# Altium schematic sheet PowerManagement.SchDoc: Power management
size A4; SheetNumber: 4; SheetTotal: 7
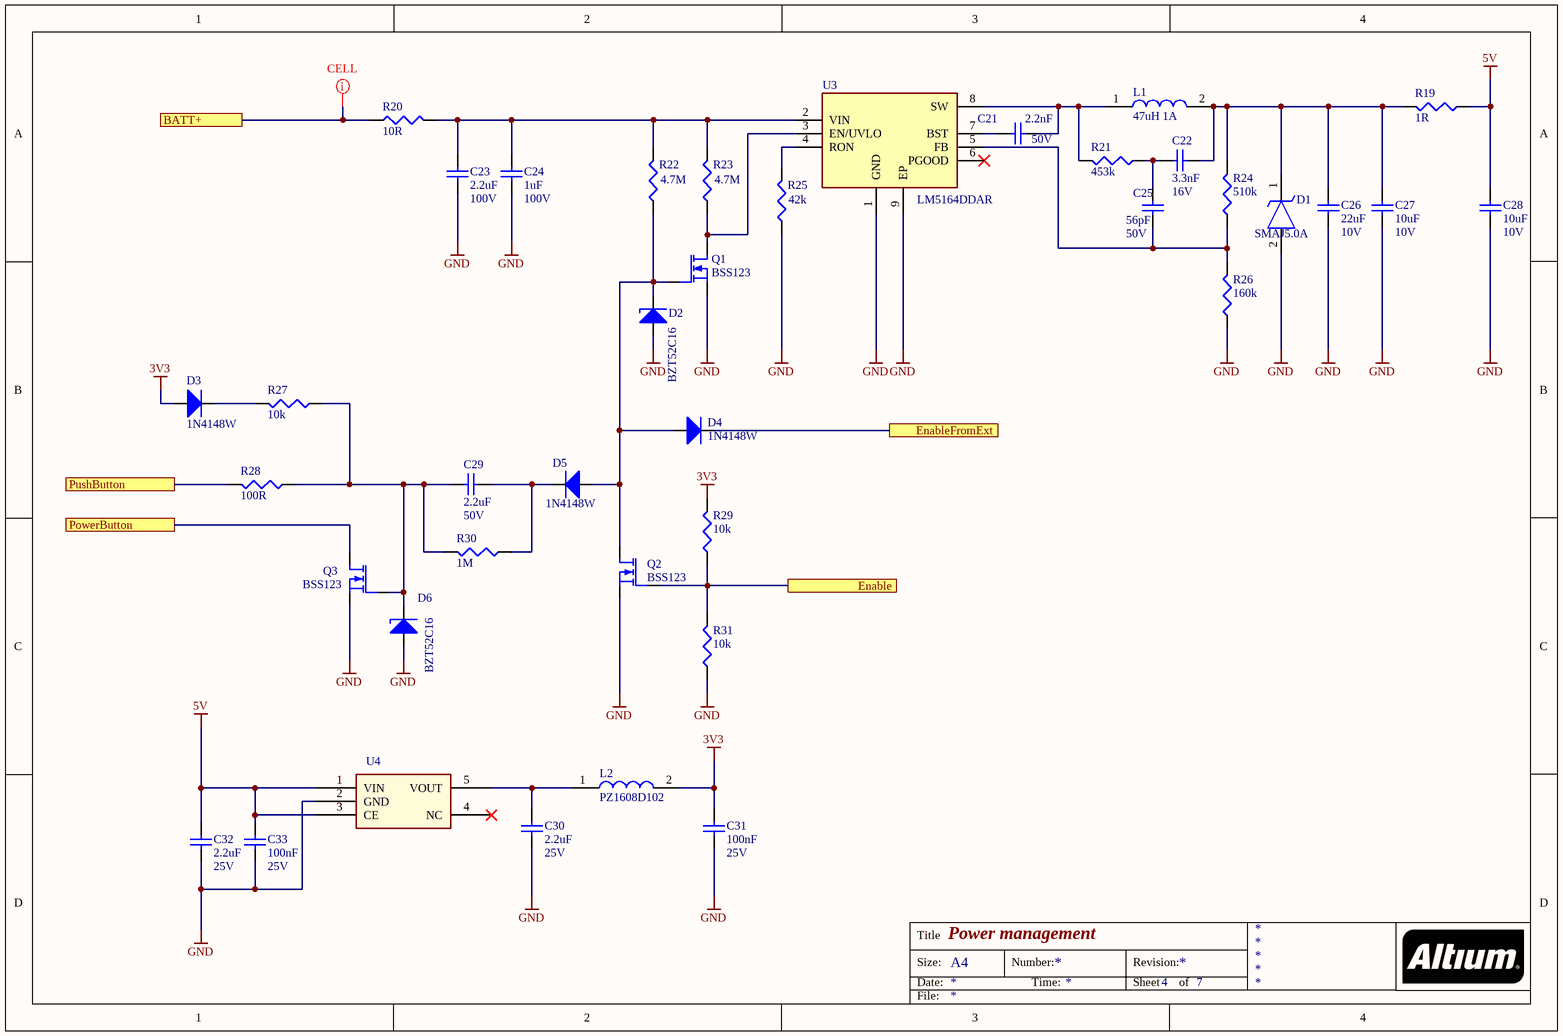
[diagram p0: PowerManagement.SchDoc]

## Parts
C21  2.2nF  Voltage Rating: 50V  [C0402]
C22  3.3nF  Voltage Rating: 16V  [C0402]
C23  2.2uF  Voltage Rating: 100V  [C-1206]
C24  1uF  Voltage Rating: 100V  [C-1206]
C25  56pF  Voltage Rating: 50V  [C0402]
C26  22uF  Voltage Rating: 10V  [C-0805]
C27  10uF  Voltage Rating: 10V  [C-0805]
C28  10uF  Voltage Rating: 10V  [C-0805]
C29  2.2uF  Voltage Rating: 50V  [C-0805]
C30  2.2uF  Voltage Rating: 25V  [C0402]
C31  100nF  Voltage Rating: 25V  [C0402]
C32  2.2uF  Voltage Rating: 25V  [C0402]
C33  100nF  Voltage Rating: 25V  [C0402]
D1  SMAJ5.0A  [SOD-123F]
D2  BZT52C16  [SOD123]
D3  1N4148W  [SOD123]
D4  1N4148W  [SOD123]
D5  1N4148W  [SOD123]
D6  BZT52C16  [SOD123]
L1  47uH 1A  [L5040]
L2  PZ1608D102  [L0603]
Q1  BSS123  [SOT-23]
Q2  BSS123  [SOT-23]
Q3  BSS123  [SOT-23]
R19  1R  [0805]
R20  10R  [R1206]
R21  453k  [0402]
R22  4.7M  [0402]
R23  4.7M  [0402]
R24  510k  [0402]
R25  42k  [0402]
R26  160k  [0402]
R27  10k  [0402]
R28  100R  [0603]
R29  10k  [0402]
R30  1M  [0402]
R31  10k  [0402]
U3  LM5164DDAR  [SOIC127P600X170-9N]
U4  XC6219B332MR  [SOT-23-5]  (value not drawn)

## Ports
BATT+, Enable, EnableFromExt, PowerButton, PushButton

## Nets
3V3: C31.1 D3.1(A) L2.2 R29.2
5V: C28.2 C32.1 C33.1 R19.1 U4.1(VIN) U4.3(CE)
GND: C23.1 C24.1 C26.1 C27.1 C28.1 C30.2 C31.2 C32.2 C33.2 D1.2(A) D2.1(A) D6.1(A) Q1.S Q2.S Q3.S R25.1 R26.1 R31.1 U3.1(GND) U3.9(EP) U4.2(GND)
BATT+: R20.1 ; port BATT+
Enable: Q2.G R29.1 R31.2 ; port Enable
EnableFromExt: D4.2(K) ; port EnableFromExt
PowerButton: Q3.D ; port PowerButton
PushButton: R28.2 ; port PushButton
NetC21_1: C21.1 U3.7(BST)
NetC21_2: C21.2 L1.1 R21.2 U3.8(SW)
NetC22_1: C22.1 C25.1 R21.1
NetC22_2: C22.2 C26.2 C27.2 D1.1(K) L1.2 R19.2 R24.2
NetC23_2: C23.2 C24.2 R20.2 R22.2 R23.2 U3.2(VIN)
NetC25_2: C25.2 R24.1 R26.2 U3.5(FB)
NetC29_1: C29.1 D6.2(K) Q3.G R27.2 R28.1 R30.2
NetC29_2: C29.2 D5.2(K) R30.1
NetC30_1: C30.1 L2.1 U4.5(VOUT)
NetD2_2: D2.2(K) D4.1(A) D5.1(A) Q1.G Q2.D R22.1
NetD3_2: D3.2(K) R27.1
NetQ1_D: Q1.D R23.1 U3.3(EN/UVLO)
NetR25_2: R25.2 U3.4(RON)

Not connected (* = marked no-connect by the designer): U3 6(PGOOD)*; U4 4(NC)*

## Layout directives
net class CELL: BATT+

## Notes on the sheet
- Title
- Size:
- Date:
- A4
- Number:
- Time:
- Revision:
- Sheet
- of
- File:

## Library data of the parts
C21 C22 C25 C30-C33 = 100nF/0402/CER/25V: Capacitor, 100nF, 25V, X7R; Capacitance Tolerance: 10nF; Capacitor Case Style: 0402; Brand Number: GRM155R71E104KE14D; Brand: MULTICOMP; Dielectric Characteristic: X7R; Capacitance: 100nF; Temperature Range: -55 to +125 C; Price: 0,0225; Order Code Supplier: 2456106; Supplier: Farnell
C23 C24 = 1uF/1206/CER/100V: Capacitor, 1uF, 100V, X7R; Capacitance Tolerance: ± 10%; Capacitor Case Style: 1206; Brand Number: 12061C105K4Z2A; Brand: AVX; Dielectric Characteristic: X7R; Capacitance: 1uF; Temperature Range: -55°C to +125°C; Price: 0,52; Order Code Supplier: 1833855; Supplier: Farnell
C26-C28 = 10uF/0805/CER/10V: Capacitor, 10uF, 10V, X7R; Capacitance Tolerance: ± 10%; Capacitor Case Style: 0805; Brand Number: GRM21BR71A106KE51L; Brand: MURATA; Dielectric Characteristic: X7R; Capacitance: 10uF; Temperature Range: -55°C to +125°C; Price: 0,36; Order Code Supplier: 1828828; Supplier: Farnell
C29 = 2.2uF/0805/CER/50V: Capacitor, 2.2uF, 50V,  X7R; Dielectric Characteristic: X5R; Capacitance Tolerance: ± 10%; Capacitor Case Style: 0805; Brand Number: GRM219R61H225KE15D; Brand: MURATA; Capacitance: 2.2uF; Temperature Range: -55°C to +125°C; Price: 0,113; Order Code Supplier: 2611933; Supplier: Farnell
D1 = SMAJ5.0A: TVS Diode (Uni-directional); Manufacturer_Name: LITTELFUSE; Manufacturer_Part_Number: SMAJ7.0A; Datasheet Link: https://www.littelfuse.com/media?resourcetype=datasheets&itemid=75e32973-b177-4ee3-a0ff-cedaf1abdb93&filename=smaj-datasheet; Height: 2.29mm; Mouser Part Number: 576-SMAJ7.0A; Mouser Price/Stock: https://www.mouser.co.uk/ProductDetail/Littelfuse/SMAJ7.0A?qs=zHiv0nsVGmqwPZkMuKJUUw%3D%3D; Arrow Part Number: SMAJ7.0A; Arrow Price/Stock: https://www.arrow.com/en/products/smaj7.0a/littelfuse?region=europe
D2 D6 = BZT52C16: Diode Zener, Vz: 16V, If: 0.1A, Vf: 0.9V; Brand: Diodes; Case Style: SOD-123; Brand Number: BZT52C16; Forward Current: 0.1A; Forward Voltage: 0.9V; Order Code Supplier: 1902431; Price: 0,087; Supplier: Farnell; Temperature Range: -65°C to +150°C; Zener Voltage: 16V
D3-D5 = MMSD4148T1G: Diode, Vrrm: 100V, If: 0.15A, Vf: 1V; Brand: ON SEMICONDUCTOR; Case Style: SOD-123; Forward Current: 0.2A; Price: 0,19; Brand Number: MMSD4148T1G; Order Code Supplier: 9556079; Supplier: Farnell; Temperature Range: -65°C to +150°C; Vrrm: 100V; Forward Voltage: 1V
L1 = 74404054221: Inductor; Manufacturer_Name: Wurth Elektronik; Datasheet Link: https://www.mouser.com/datasheet/2/445/74404054221-1280555.pdf; Height: 4mm; Manufacturer_Part_Number: 74404054221; Mouser Part Number: 710-74404054221; Mouser Price/Stock: https://www.mouser.co.uk/ProductDetail/Wurth-Elektronik/74404054221?qs=f9yNj16SXrLBSuRgk86STQ%3D%3D
L2 = PZ1608D102: Inductor; Manufacturer_Name: Murata Electronics; Manufacturer_Part_Number: LQG15HS4N7C02D; Datasheet Link: https://search.murata.co.jp/Ceramy/image/img/P02/JELF243B-0010.pdf; Height: 0.6mm; Mouser Part Number: 81-LQG15HS4N7C02D; Mouser Price/Stock: https://www.mouser.co.uk/ProductDetail/Murata-Electronics/LQG15HS4N7C02D?qs=60uY6ySkanQsgm4t8ngjFA%3D%3D; Arrow Part Number: LQG15HS4N7C02D; Arrow Price/Stock: https://www.arrow.com/en/products/lqg15hs4n7c02d/murata-manufacturing
Q1-Q3 = BSS123: Mosfet, N-channel, Vds:100V, Id:0.15A, Vgs-th:2.8V, Rds-on:3.5ohm; Brand: NXP; Drain Current: 0.15A; Drain Source Voltage: 100V; Gate Source Voltage: 20V; On Resistance: 3.5ohm; Threshold Voltage: 2.8V; Brand Number: BSS123; Case Style: SOT-23; Order Code Supplier: 1510764; Price: 0,082; Supplier: Farnell; Temperature Range: -55°C to +150°C; Transistor Polarity: N-channel
R19 = 1/0805/0250W/150V: Resistor, 1R, 1%, 0.25W, 150V, 200PPM, 0805; Brand: PANASONIC; Brand Number: ERJ6BQF1R0V; Case Style: 0805; Order Code Supplier: 1717826; Power Rating: 0.25W; Price: 0,28; Resistance: 1R; Supplier: Farnell; Temperature Coefficient: ± 200PPM; Temperature Range: -55°C to +125°C; Voltage Rating: 150V
R20 = RQ73C2B10RBTDF: Resistor; Manufacturer_Name: TE Connectivity; Datasheet Link: https://www.te.com/commerce/DocumentDelivery/DDEController?Action=showdoc&DocId=Data+Sheet%7F1773270-2%7FB%7Fpdf%7FEnglish%7FENG_DS_1773270-2_B.pdf%7F2176383-1; Height: 0.65mm; Manufacturer_Part_Number: RQ73C2B10RBTDF
R21-R26 R30 = 1M/0402/0063W/50V: Resistor, 1M, 0.1%, 0.0625W, 50V, 100PPM, 0402; Brand: VISHAY DRALORIC; Brand Number: CRCW04021M00FKED; Power Rating: 0.063W; Case Style: 0402; Order Code Supplier: 2121984; Price: 0,0006; Resistance: 1M; Supplier: Farnell; Temperature Coefficient: ± 100PPM; Temperature Range: -55°C to +125°C; Voltage Rating: 50V
R27 R29 R31 = 10k/0402/0063W/50V: Resistor, 10k, 0.1%, 0.0625W, 50V, 100PPM, 0402; Brand: VISHAY DRALORIC; Brand Number: CRCW040210K0FKED; Power Rating: 0.063W; Case Style: 0402; Order Code Supplier: 2121730; Price: 0,0005; Resistance: 10k; Supplier: Farnell; Temperature Coefficient: ± 100PPM; Temperature Range: -55°C to +125°C; Voltage Rating: 50V
R28 = 100/0603/0063W/50V: Resistor, 100R, 1%, 0.063W, 50V, 200PPM, 0603; Brand: VISHAY DRALORIC; Brand Number: CRCW0603100RFKEA; Case Style: 0603; Order Code Supplier: 2122239; Power Rating: 0.063W; Price: 0,007; Resistance: 100R; Supplier: Farnell; Temperature Coefficient: ± 200PPM; Temperature Range: -55°C to +125°C; Voltage Rating: 50V
U3 = LM5164DDAR: Integrated Circuit; Manufacturer_Name: Texas Instruments; Datasheet Link: http://www.ti.com/lit/ds/symlink/lm5164.pdf; Height: 1.7mm; Manufacturer_Part_Number: LM5164DDAR; Mouser Part Number: 595-LM5164DDAR; Mouser Price/Stock: https://www.mouser.co.uk/ProductDetail/Texas-Instruments/LM5164DDAR?qs=PqoDHHvF64%2F0M%252BK9zcb2mw%3D%3D; Arrow Part Number: LM5164DDAR; Arrow Price/Stock: https://www.arrow.com/en/products/lm5164ddar/texas-instruments?utm_currency=USD&region=nac